# Altium project Sound_Card.PrjPcb
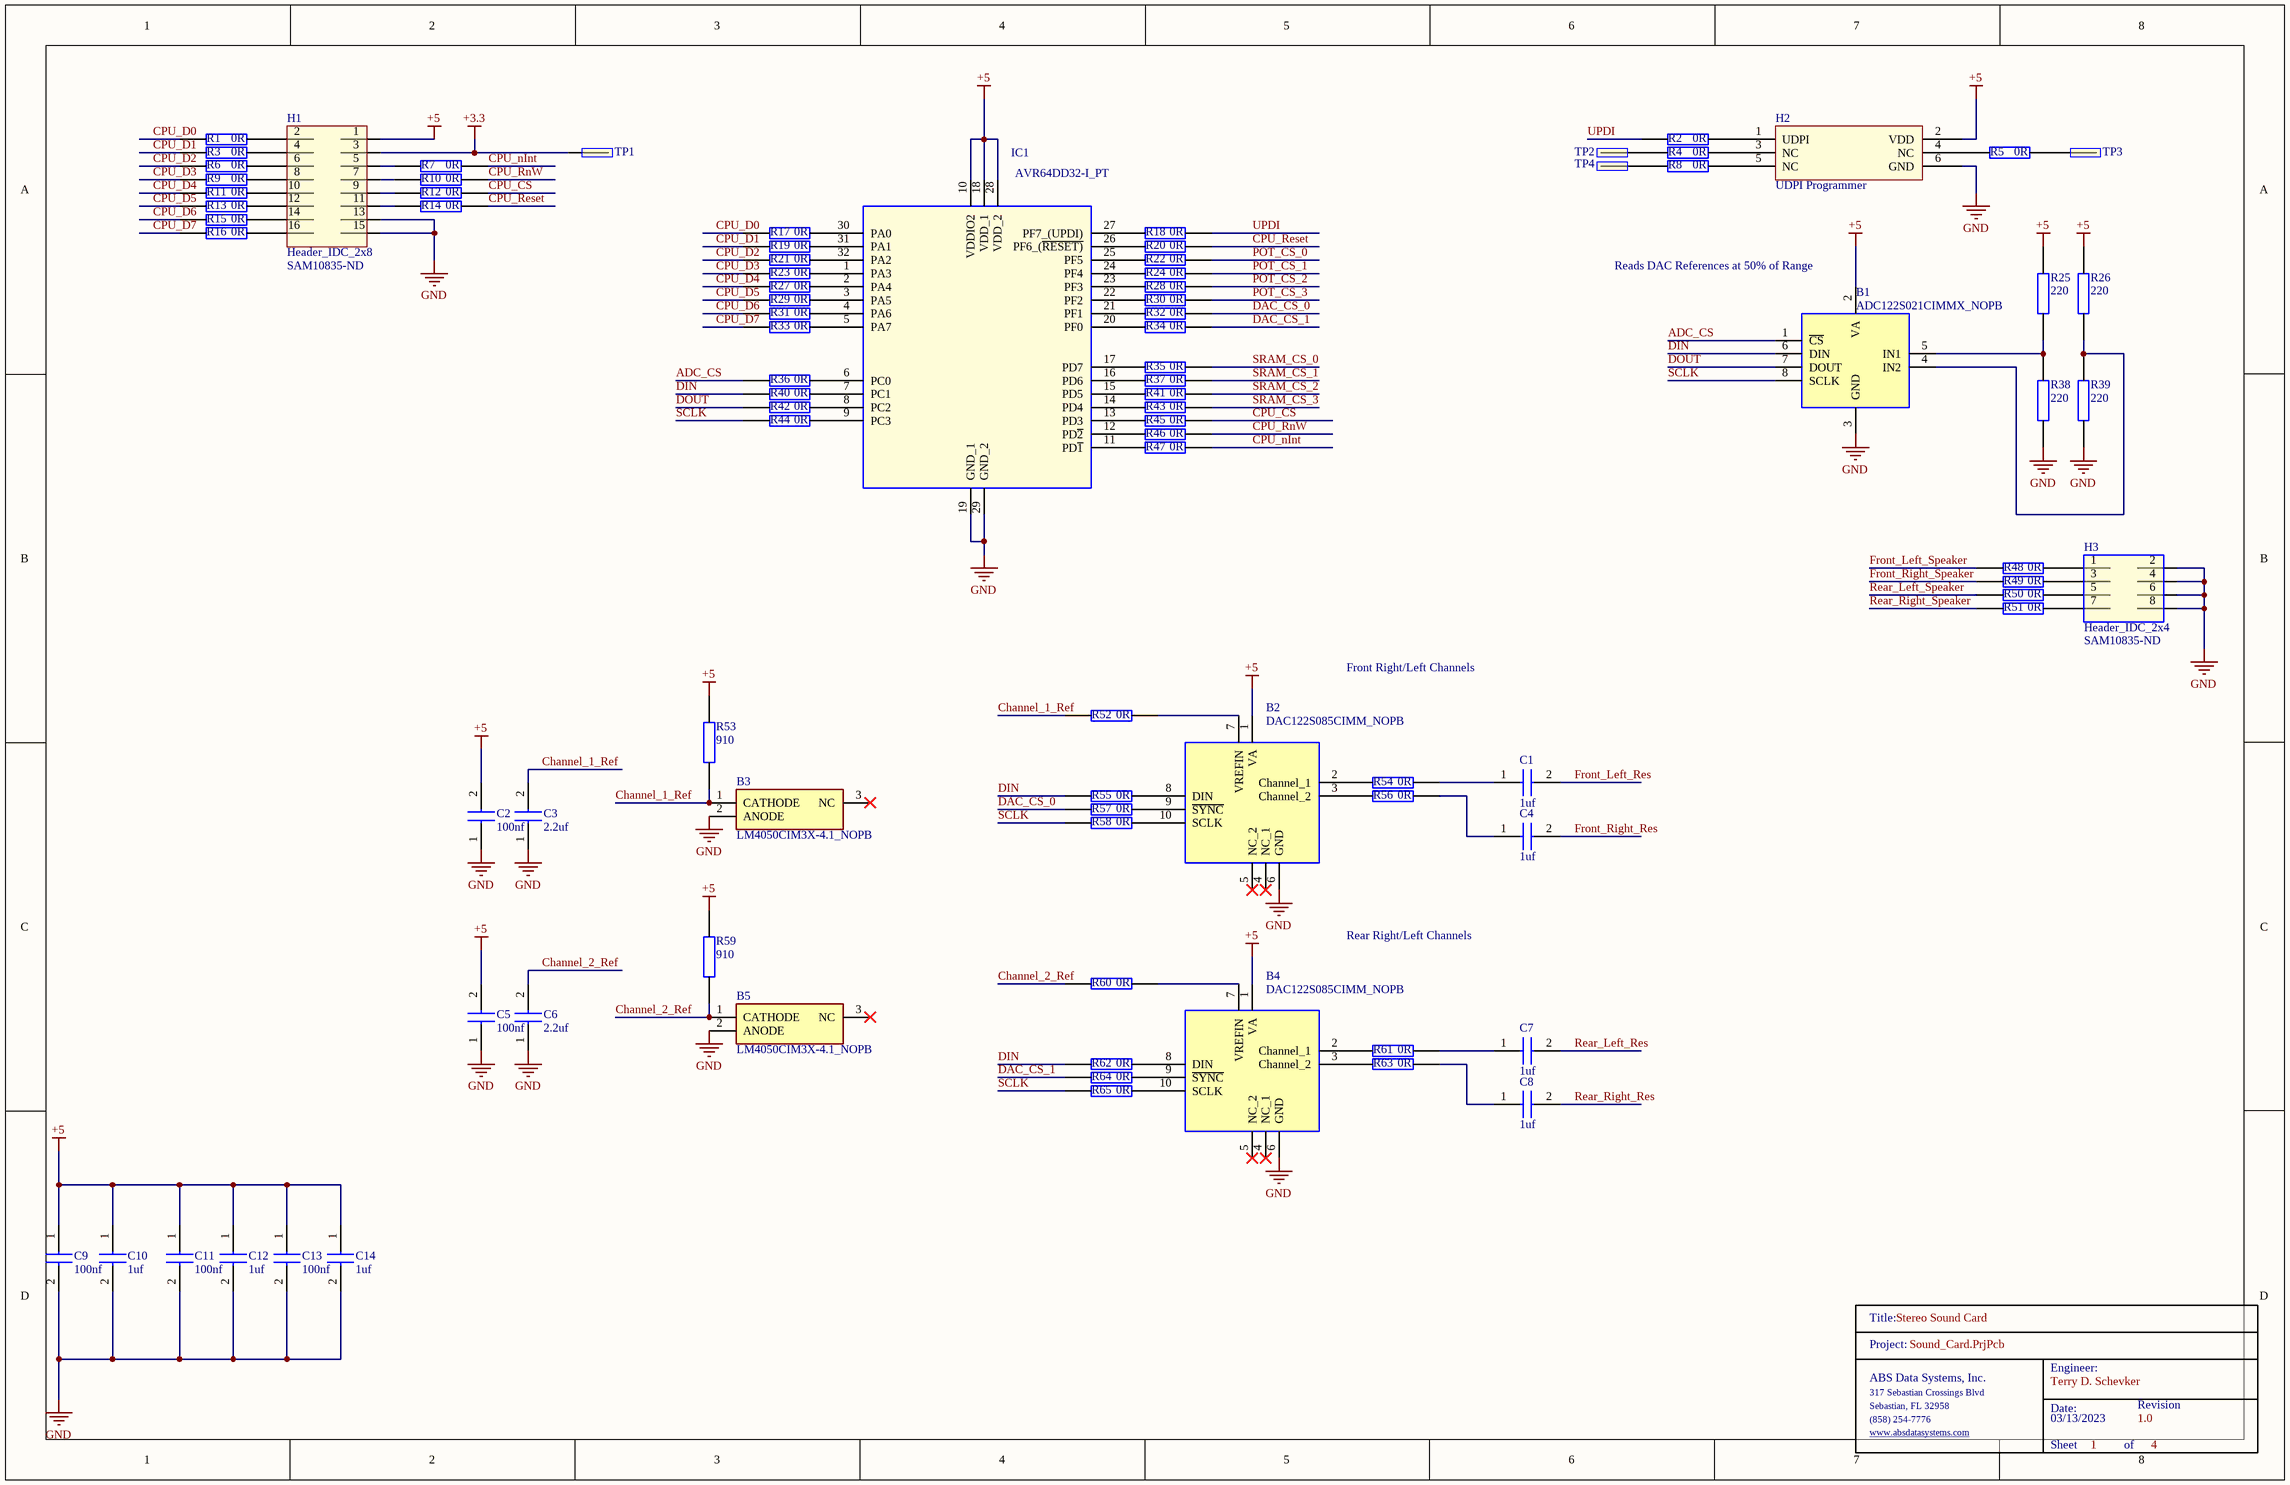
[diagram p0: Sound_Card.SchDoc]
4 sheets, 271 parts. Net scope: global (net labels, ports and power ports of the same name join across sheets).
Board file: Sound_Card_PCB.PcbDoc
Sheets:
  Sound_Card.SchDoc
  Ampifiler.SchDoc
  Sound_Ram_Buffer.SchDoc
  Sound_Card_LED_Monitor.SchDoc

## Sheet Sound_Card.SchDoc: Stereo Sound Card
size Tabloid; Date: 03/13/2023; Engineer: Terry D. Schevker; Revision: 1.0; SheetNumber: 1; SheetTotal: 4

### Parts
B1  ADC122S021CIMMX_NOPB  [SOP65P490X110-8N]
B2  DAC122S085CIMM_NOPB  [SOP50P490X110-10N]
B3  LM4050CIM3X-4.1_NOPB  [SOT95P237X95-3N]
B4  DAC122S085CIMM_NOPB  [SOP50P490X110-10N]
B5  LM4050CIM3X-4.1_NOPB  [SOT95P237X95-3N]
C1  1uf  [0603]
C2  100nf  [0603]
C3  2.2uf  [0603]
C4  1uf  [0603]
C5  100nf  [0603]
C6  2.2uf  [0603]
C7  1uf  [0603]
C8  1uf  [0603]
C9  100nf  [0603]
C10  1uf  [0603]
C11  100nf  [0603]
C12  1uf  [0603]
C13  100nf  [0603]
C14  1uf  [0603]
H1  Header_IDC_2x8  Supplier Part Number 1: SAM10835-ND  [HEADER16]
H2  UDPI Programmer  [HDR2X3]
H3  Header_IDC_2x4  Supplier Part Number 1: SAM10835-ND  [HDR2X4]
IC1  AVR64DD32-I_PT  [QFP80P900X900X120-32N]
R1  0R  [0603]
R2  0R  [0603]
R3  0R  [0603]
R4  0R  [0603]
R5  0R  [0603]
R6  0R  [0603]
R7  0R  [0603]
R8  0R  [0603]
R9  0R  [0603]
R10  0R  [0603]
R11  0R  [0603]
R12  0R  [0603]
R13  0R  [0603]
R14  0R  [0603]
R15  0R  [0603]
R16  0R  [0603]
R17  0R  [0603]
R18  0R  [0603]
R19  0R  [0603]
R20  0R  [0603]
R21  0R  [0603]
R22  0R  [0603]
R23  0R  [0603]
R24  0R  [0603]
R25  220  [0603]
R26  220  [0603]
R27  0R  [0603]
R28  0R  [0603]
R29  0R  [0603]
R30  0R  [0603]
R31  0R  [0603]
R32  0R  [0603]
R33  0R  [0603]
R34  0R  [0603]
R35  0R  [0603]
R36  0R  [0603]
R37  0R  [0603]
R38  220  [0603]
R39  220  [0603]
R40  0R  [0603]
R41  0R  [0603]
R42  0R  [0603]
R43  0R  [0603]
R44  0R  [0603]
R45  0R  [0603]
R46  0R  [0603]
R47  0R  [0603]
R48  0R  [0603]
R49  0R  [0603]
R50  0R  [0603]
R51  0R  [0603]
R52  0R  [0603]
R53  910  [0603]
R54  0R  [0603]
R55  0R  [0603]
R56  0R  [0603]
R57  0R  [0603]
R58  0R  [0603]
R59  910  [0603]
R60  0R  [0603]
R61  0R  [0603]
R62  0R  [0603]
R63  0R  [0603]
R64  0R  [0603]
R65  0R  [0603]
TitleBlock_1  TitleBlock  (value not drawn)  (graphical)
TP1  TP  [TP]  (value not drawn)
TP2  TP  [TP]  (value not drawn)
TP3  TP  [TP]  (value not drawn)
TP4  TP  [TP]  (value not drawn)

### Nets
+3.3: H1.3 TP1.1
+5: B1.2(VA) B2.1(VA) B4.1(VA) C2.2 C5.2 C9.1 C10.1 C11.1 C12.1 C13.1 C14.1 H1.1 H2.2(VDD) IC1.10(VDDIO2) IC1.18(VDD_1) IC1.28(VDD_2) R25.1 R26.2 R53.1 R59.1
GND: B1.3(GND) B2.6(GND) B3.2(ANODE) B4.6(GND) B5.2(ANODE) C2.1 C3.1 C5.1 C6.1 C9.2 C10.2 C11.2 C12.2 C13.2 C14.2 H1.13 H1.15 H2.6(GND) H3.2 H3.4 H3.6 H3.8 IC1.19(GND_1) IC1.29(GND_2) R38.1 R39.2
ADC_CS: B1.1(~{CS}) R36.1
Channel_1_Ref: B3.1(CATHODE) C3.2 R52.1 R53.2
Channel_2_Ref: B5.1(CATHODE) C6.2 R59.2 R60.1
CPU_CS: R12.2 R45.2
CPU_D0: R1.1 R17.1
CPU_D1: R3.1 R19.1
CPU_D2: R6.1 R21.1
CPU_D3: R9.1 R23.1
CPU_D4: R11.1 R27.1
CPU_D5: R13.1 R29.1
CPU_D6: R15.1 R31.1
CPU_D7: R16.1 R33.1
CPU_nInt: R7.2 R47.2
CPU_Reset: R14.2 R20.2
CPU_RnW: R10.2 R46.2
DAC_CS_0: R32.2 R57.1
DAC_CS_1: R34.2 R64.1
DIN: B1.6(DIN) R40.1 R55.1 R62.1
DOUT: B1.7(DOUT) R42.1
Front_Left_Res: C1.2
Front_Left_Speaker: R48.1
Front_Right_Res: C4.2
Front_Right_Speaker: R49.1
POT_CS_0: R22.2
POT_CS_1: R24.2
POT_CS_2: R28.2
POT_CS_3: R30.2
Rear_Left_Res: C7.2
Rear_Left_Speaker: R50.1
Rear_Right_Res: C8.2
Rear_Right_Speaker: R51.1
SCLK: B1.8(SCLK) R44.1 R58.1 R65.1
SRAM_CS_0: R35.2
SRAM_CS_1: R37.2
SRAM_CS_2: R41.2
SRAM_CS_3: R43.2
UPDI: R2.1 R18.2
NetB1_4: B1.4(IN2) R26.1 R39.1
NetB1_5: B1.5(IN1) R25.2 R38.2
NetB2_2: B2.2(Channel_1) R54.1
NetB2_3: B2.3(Channel_2) R56.1
NetB2_7: B2.7(VREFIN) R52.2
NetB2_8: B2.8(DIN) R55.2
NetB2_9: B2.9(~{SYNC}) R57.2
NetB2_10: B2.10(SCLK) R58.2
NetB4_2: B4.2(Channel_1) R61.1
NetB4_3: B4.3(Channel_2) R63.1
NetB4_7: B4.7(VREFIN) R60.2
NetB4_8: B4.8(DIN) R62.2
NetB4_9: B4.9(~{SYNC}) R64.2
NetB4_10: B4.10(SCLK) R65.2
NetC1_1: C1.1 R54.2
NetC4_1: C4.1 R56.2
NetC7_1: C7.1 R61.2
NetC8_1: C8.1 R63.2
NetH1_2: H1.2 R1.2
NetH1_4: H1.4 R3.2
NetH1_5: H1.5 R7.1
NetH1_6: H1.6 R6.2
NetH1_7: H1.7 R10.1
NetH1_8: H1.8 R9.2
NetH1_9: H1.9 R12.1
NetH1_10: H1.10 R11.2
NetH1_11: H1.11 R14.1
NetH1_12: H1.12 R13.2
NetH1_14: H1.14 R15.2
NetH1_16: H1.16 R16.2
NetH2_1: H2.1(UDPI) R2.2
NetH2_3: H2.3(NC) R4.2
NetH2_4: H2.4(NC) R5.1
NetH2_5: H2.5(NC) R8.2
NetH3_1: H3.1 R48.2
NetH3_3: H3.3 R49.2
NetH3_5: H3.5 R50.2
NetH3_7: H3.7 R51.2
NetIC1_1: IC1.1(PA3) R23.2
NetIC1_2: IC1.2(PA4) R27.2
NetIC1_3: IC1.3(PA5) R29.2
NetIC1_4: IC1.4(PA6) R31.2
NetIC1_5: IC1.5(PA7) R33.2
NetIC1_6: IC1.6(PC0) R36.2
NetIC1_7: IC1.7(PC1) R40.2
NetIC1_8: IC1.8(PC2) R42.2
NetIC1_9: IC1.9(PC3) R44.2
NetIC1_11: IC1.11(PD~{1}) R47.1
NetIC1_12: IC1.12(PD~{2}) R46.1
NetIC1_13: IC1.13(PD3) R45.1
NetIC1_14: IC1.14(PD4) R43.1
NetIC1_15: IC1.15(PD5) R41.1
NetIC1_16: IC1.16(PD6) R37.1
NetIC1_17: IC1.17(PD7) R35.1
NetIC1_20: IC1.20(PF0) R34.1
NetIC1_21: IC1.21(PF1) R32.1
NetIC1_22: IC1.22(PF2) R30.1
NetIC1_23: IC1.23(PF3) R28.1
NetIC1_24: IC1.24(PF4) R24.1
NetIC1_25: IC1.25(PF5) R22.1
NetIC1_26: IC1.26(PF6_(~{RESET)}) R20.1
NetIC1_27: IC1.27(PF7_(UPDI)) R18.1
NetIC1_30: IC1.30(PA0) R17.2
NetIC1_31: IC1.31(PA1) R19.2
NetIC1_32: IC1.32(PA2) R21.2
NetR4_1: R4.1 TP2.1
NetR5_2: R5.2 TP3.1
NetR8_1: R8.1 TP4.1

Not connected (* = marked no-connect by the designer): B2 4(NC_1)* 5(NC_2)*; B3 3(NC)*; B4 4(NC_1)* 5(NC_2)*; B5 3(NC)*

### Notes on the sheet
- (near B1) Reads DAC References at 50% of Range
- Front Right/Left Channels
- Rear Right/Left Channels
- (in symbol TitleBlock) Title:; Project:; Engineer:; ABS Data Systems, Inc.; 317 Sebastian Crossings Blvd; Sebastian, FL 32958; Date:; Revision; (858) 254-7776; www.absdatasystems.com; Sheet; of

### Library data of the parts
B1 = ADC122S021CIMMX_NOPB: 2 Channel, 50 ksps to 200 ksps 12-Bit A/D Converter; Manufacturer_Name: Texas Instruments; Manufacturer_Part_Number: ADC122S021CIMMX/NOPB; Geometry.Height: 1.1mm; Mouser Part Number: 926-A122S021CIMMXNPB; Mouser Price/Stock: https://www.mouser.co.uk/ProductDetail/Texas-Instruments/ADC122S021CIMMX-NOPB/?qs=7X5t%252BdzoRHB2bC7Teu8H3A%3D%3D; Datasheet Link: http://www.ti.com/lit/gpn/ADC122S021
B2 B4 = DAC122S085CIMM_NOPB: 12-Bit Micro Power DUAL Digital-to-Analog Converter with Rail-to-Rail Output; Manufacturer_Name: Texas Instruments; Manufacturer_Part_Number: DAC122S085CIMM/NOPB; Geometry.Height: 1.1mm; Mouser Part Number: 926-DAC122S085CIMMNO; Mouser Price/Stock: https://www.mouser.co.uk/ProductDetail/Texas-Instruments/DAC122S085CIMM-NOPB/?qs=7X5t%252BdzoRHCSswOz%252BE6yGA%3D%3D; Datasheet Link: http://www.ti.com/lit/gpn/dac122s085
B3 B5 = LM4050CIM3X-4.1_NOPB: 50ppm/C Precision Micropower Shunt Voltage Reference; Manufacturer_Name: Texas Instruments; Manufacturer_Part_Number: LM4050CIM3X-4.1/NOPB; Geometry.Height: 0.95mm; Mouser Part Number: 926-LM4050CIM3X41NPB; Mouser Price/Stock: https://www.mouser.co.uk/ProductDetail/Texas-Instruments/LM4050CIM3X-4.1-NOPB?qs=QbsRYf82W3Em%2F29oRlpByg%3D%3D; Datasheet Link: http://www.ti.com/lit/gpn/lm4050-n
C1 C4 C7 C8 C10 C12 C14 = CL10B105KA8NNNL: Samsung Electro-Mechanics 0603 1uf
C2 C5 C9 C11 C13 = CL10B104JB8NNNC: Samsung Electro-Mechanics 0603 100nf
C3 C6 = CL10B225KP8NNNC: Samsung Electro-Mechanics 0603 2.2uf
H1 = Header_IDC_2x8: 16 Pin 2x8 Through Hold IDC Connector; Manufacturer: Samtec; Manufacturer Part Number: TST-108-01-G-D; Number of Contacts: 16; Gender: Male; Connector Type: Male Pin; Pitch: 2.54mm; Row Spacing: 0.1inch; Supplier 1: Digi-Key; RoHS: Yes; Category: Headers and Wire Housings; Stock 1: 227; Pricing 1: 1=2.85000, 10=2.73600, 100=2.28000, 500=1.93800, 1000=1.65300, 5000=1.48200 (USD); Mount: Through Hole; Contact Plating: Gold; Contact Material: Bronze; Housing Material: Polyester; Housing Color: Black; Color: Black; Min Operating Temperature: -55°C; Max Operating Temperature: 125°C; Number of Rows: 2; Termination: Solder; Packaging: Rail/Tube; Orientation: Straight; Number of Positions: 16; Length: 27.94mm; Depth: 9.27mm; Contact Mating Length: 0.25inch; REACH SVHC: No SVHC; ComponentLink1URL: https://datasheet.ciiva.com/739/tst-mkt-739845.pdf?src-supplier=Digi-Key; ComponentLink1Description: https://datasheet.ciiva.com/739/tst-mkt-739845.pdf?src-supplier=Digi-Key; ComponentLink2URL: https://datasheet.ciiva.com/10018/htst-10018510.pdf?src-supplier=Avnet; ComponentLink2Description: https://datasheet.ciiva.com/10018/htst-10018510.pdf?src-supplier=Avnet
H2 = UDPI Programmer: 6 Pin 2X3 Through Hole Header
H3 = Header_IDC_2x4: 8 Pin 2x4 Through Hold IDC Connector; Manufacturer: Samtec; Manufacturer Part Number: TST-105-01-G-D; Number of Contacts: 16; Gender: Male; Connector Type: Male Pin; Pitch: 2.54mm; Row Spacing: 0.1inch; Supplier 1: Digi-Key; RoHS: Yes; Category: Headers and Wire Housings; Stock 1: 227; Pricing 1: 1=2.85000, 10=2.73600, 100=2.28000, 500=1.93800, 1000=1.65300, 5000=1.48200 (USD); Mount: Through Hole; Contact Plating: Gold; Contact Material: Bronze; Housing Material: Polyester; Housing Color: Black; Color: Black; Min Operating Temperature: -55°C; Max Operating Temperature: 125°C; Number of Rows: 2; Termination: Solder; Packaging: Rail/Tube; Orientation: Straight; Number of Positions: 16; Length: 27.94mm; Depth: 9.27mm; Contact Mating Length: 0.25inch; REACH SVHC: No SVHC; ComponentLink1URL: https://datasheet.ciiva.com/739/tst-mkt-739845.pdf?src-supplier=Digi-Key; ComponentLink1Description: https://datasheet.ciiva.com/739/tst-mkt-739845.pdf?src-supplier=Digi-Key; ComponentLink2URL: https://datasheet.ciiva.com/10018/htst-10018510.pdf?src-supplier=Avnet; ComponentLink2Description: https://datasheet.ciiva.com/10018/htst-10018510.pdf?src-supplier=Avnet
IC1 = AVR64DD32-I_PT: Integrated Circuit; Manufacturer_Name: Microchip; Manufacturer_Part_Number: AVR64DD32-I/PT | MULTI-VOLTAGE I/O; Datasheet Link: https://www.microchip.com/en-us/product/AVR64DD32; Height: 1.2mm
R1-R24 R27-R37 R40-R52 R54-R58 R60-R65 = RC0603JR-070RL: YAGEO 0603 0 ohm; Manufacturer_Name: KEMET; Geometry.Height: 0.55mm; Mouser Part Number: 603-RC0603JR-070RL; Mouser Price/Stock: https://www.mouser.co.uk/ProductDetail/YAGEO/RC0603JR-070RL?qs=2cAdsCoAWRGWyPcuXgGiXQ%3D%3D; Manufacturer_Part_Number: RC0603JR-070RL; Datasheet Link: https://datasheet.datasheetarchive.com/originals/distributors/Datasheets_SAMA/902f9e387b938f871d31120f5fc1d65e.pdf
R25 R26 R38 R39 = RC0603JR-07220RL: YAGEO 0603 220 ohm; Manufacturer_Name: KEMET; Manufacturer_Part_Number: RC0603JR-070RL; Geometry.Height: 0.55mm; Mouser Part Number: 603-RC0603JR-070RL; Mouser Price/Stock: https://www.mouser.co.uk/ProductDetail/YAGEO/RC0603JR-070RL?qs=2cAdsCoAWRGWyPcuXgGiXQ%3D%3D; Datasheet Link: https://datasheet.datasheetarchive.com/originals/distributors/Datasheets_SAMA/902f9e387b938f871d31120f5fc1d65e.pdf
R53 R59 = RT0603BRC07910RL: YAGEO 0603 910 ohm; Manufacturer_Name: KEMET; Manufacturer_Part_Number: RC0603JR-070RL; Geometry.Height: 0.55mm; Mouser Part Number: 603-RC0603JR-070RL; Mouser Price/Stock: https://www.mouser.co.uk/ProductDetail/YAGEO/RC0603JR-070RL?qs=2cAdsCoAWRGWyPcuXgGiXQ%3D%3D; Datasheet Link: https://datasheet.datasheetarchive.com/originals/distributors/Datasheets_SAMA/902f9e387b938f871d31120f5fc1d65e.pdf
TP1-TP4 = TP: Manufacturer: Samtec; Manufacturer Part Number: TST-105-01-G-D; Number of Contacts: 16; Gender: Male; Connector Type: Male Pin; Pitch: 2.54mm; Row Spacing: 0.1inch; Supplier 1: Digi-Key; RoHS: Yes; Category: Headers and Wire Housings; Stock 1: 227; Pricing 1: 1=2.85000, 10=2.73600, 100=2.28000, 500=1.93800, 1000=1.65300, 5000=1.48200 (USD); Mount: Through Hole; Contact Plating: Gold; Contact Material: Bronze; Housing Material: Polyester; Housing Color: Black; Color: Black; Min Operating Temperature: -55°C; Max Operating Temperature: 125°C; Number of Rows: 2; Termination: Solder; Packaging: Rail/Tube; Orientation: Straight; Number of Positions: 16; Length: 27.94mm; Depth: 9.27mm; Contact Mating Length: 0.25inch; REACH SVHC: No SVHC; ComponentLink1URL: https://datasheet.ciiva.com/739/tst-mkt-739845.pdf?src-supplier=Digi-Key; ComponentLink1Description: https://datasheet.ciiva.com/739/tst-mkt-739845.pdf?src-supplier=Digi-Key; ComponentLink2URL: https://datasheet.ciiva.com/10018/htst-10018510.pdf?src-supplier=Avnet; ComponentLink2Description: https://datasheet.ciiva.com/10018/htst-10018510.pdf?src-supplier=Avnet

## Sheet Ampifiler.SchDoc: Sound Card Amplifiers
size Tabloid; Date: 05/10/2023; Engineer: Terry D. Scchevker; Revision: 1.0; SheetNumber: 2; SheetTotal: 4
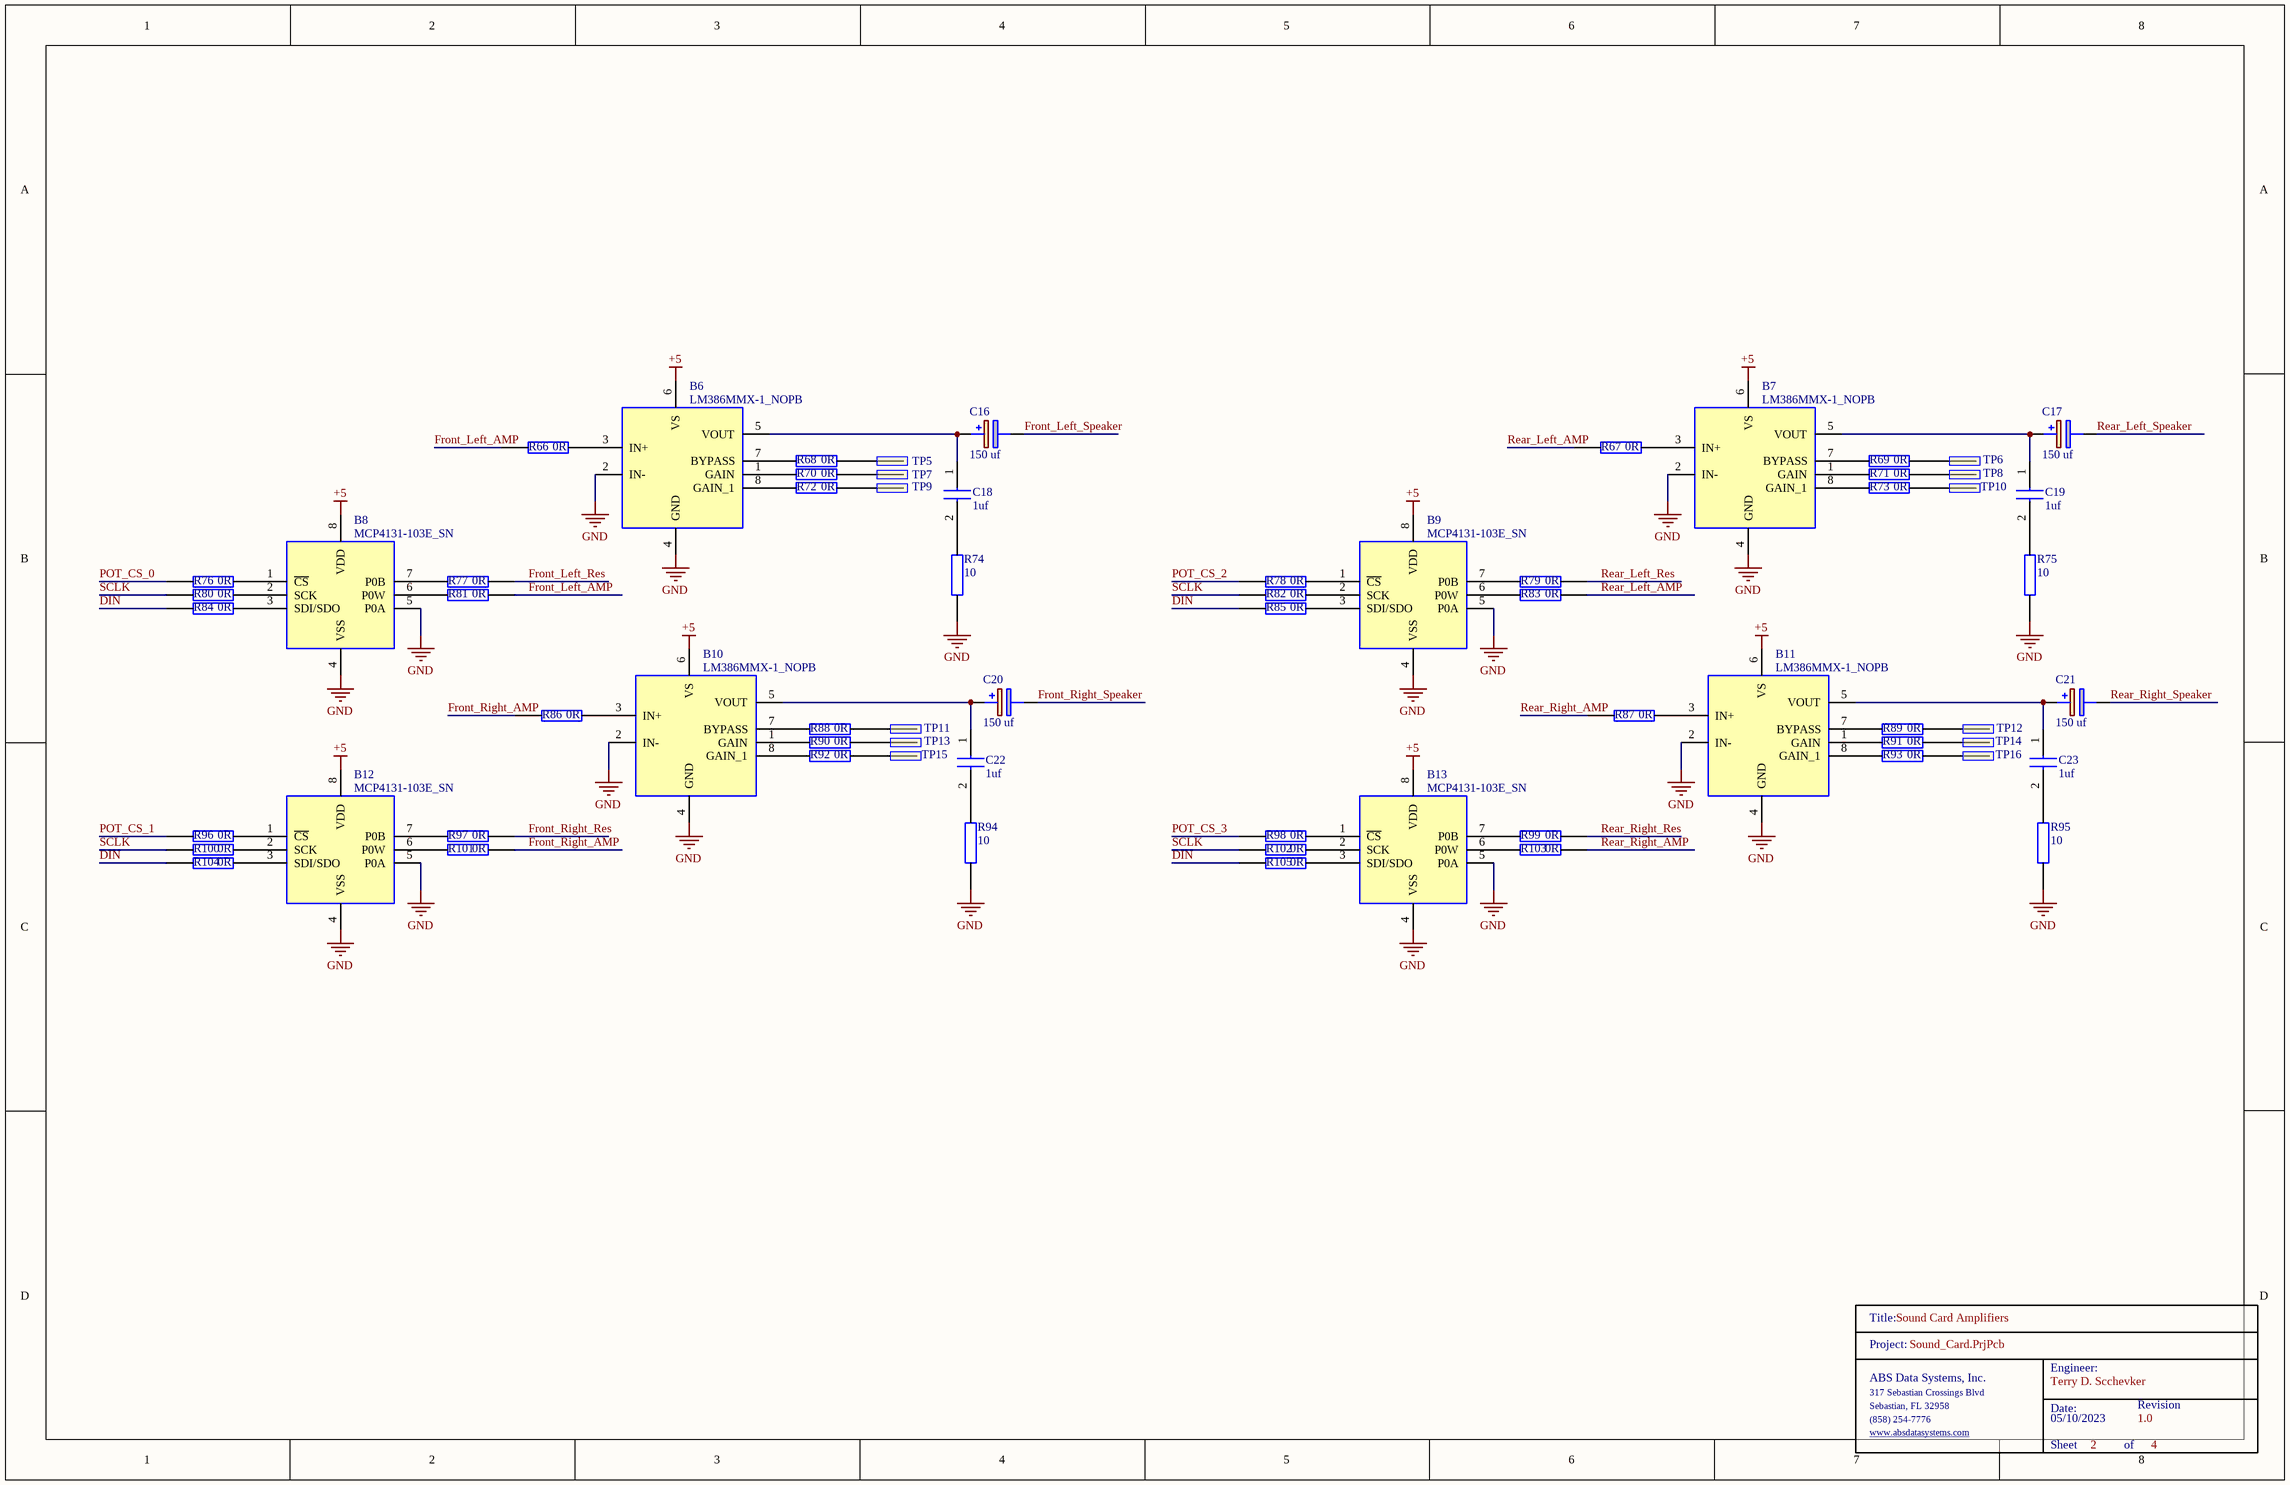
[diagram p1: Ampifiler.SchDoc]

### Parts
(Parts that share a designator on the sheet are numbered #1, #2 ... from top to bottom, then left to right.)
B6  LM386MMX-1_NOPB  [SOP65P490X110-8N]
B7  LM386MMX-1_NOPB  [SOP65P490X110-8N]
B8  MCP4131-103E_SN  [SOIC127P600X175-8N]
B9  MCP4131-103E_SN  [SOIC127P600X175-8N]
B10  LM386MMX-1_NOPB  [SOP65P490X110-8N]
B11  LM386MMX-1_NOPB  [SOP65P490X110-8N]
B12  MCP4131-103E_SN  [SOIC127P600X175-8N]
B13  MCP4131-103E_SN  [SOIC127P600X175-8N]
C16  150 uf  [CAPAE830X1050N]
C17  150 uf  [CAPAE830X1050N]
C18  1uf  [0603]
C19  1uf  [0603]
C20  150 uf  [CAPAE830X1050N]
C21  150 uf  [CAPAE830X1050N]
C22  1uf  [0603]
C23  1uf  [0603]
R66  0R  [0603]
R67  0R  [0603]
R68  0R  [0603]
R69  0R  [0603]
R70  0R  [0603]
R71  0R  [0603]
R72  0R  [0603]
R73  0R  [0603]
R74  10  [0603]
R75  10  [0603]
R76  0R  [0603]
R77  0R  [0603]
R78  0R  [0603]
R79  0R  [0603]
R80  0R  [0603]
R81  0R  [0603]
R82  0R  [0603]
R83  0R  [0603]
R84  0R  [0603]
R85  0R  [0603]
R86  0R  [0603]
R87  0R  [0603]
R88  0R  [0603]
R89  0R  [0603]
R90  0R  [0603]
R91  0R  [0603]
R92  0R  [0603]
R93  0R  [0603]
R94  10  [0603]
R95  10  [0603]
R96  0R  [0603]
R97  0R  [0603]
R98  0R  [0603]
R99  0R  [0603]
R100  0R  [0603]
R101  0R  [0603]
R102  0R  [0603]
R103  0R  [0603]
R104  0R  [0603]
R105  0R  [0603]
TitleBlock_?#1  TitleBlock  (value not drawn)  (graphical)
TP5  TP  [TP]  (value not drawn)
TP6  TP  [TP]  (value not drawn)
TP7  TP  [TP]  (value not drawn)
TP8  TP  [TP]  (value not drawn)
TP9  TP  [TP]  (value not drawn)
TP10  TP  [TP]  (value not drawn)
TP11  TP  [TP]  (value not drawn)
TP12  TP  [TP]  (value not drawn)
TP13  TP  [TP]  (value not drawn)
TP14  TP  [TP]  (value not drawn)
TP15  TP  [TP]  (value not drawn)
TP16  TP  [TP]  (value not drawn)

### Nets
+5: B6.6(VS) B7.6(VS) B8.8(VDD) B9.8(VDD) B10.6(VS) B11.6(VS) B12.8(VDD) B13.8(VDD)
GND: B6.2(IN-) B6.4(GND) B7.2(IN-) B7.4(GND) B8.4(VSS) B8.5(P0A) B9.4(VSS) B9.5(P0A) B10.2(IN-) B10.4(GND) B11.2(IN-) B11.4(GND) B12.4(VSS) B12.5(P0A) B13.4(VSS) B13.5(P0A) R74.1 R75.1 R94.1 R95.1
DIN: R84.1 R85.1 R104.1 R105.1
Front_Left_AMP: R66.1 R81.2
Front_Left_Res: R77.2
Front_Left_Speaker: C16.2(-)
Front_Right_AMP: R86.1 R101.2
Front_Right_Res: R97.2
Front_Right_Speaker: C20.2(-)
POT_CS_0: R76.1
POT_CS_1: R96.1
POT_CS_2: R78.1
POT_CS_3: R98.1
Rear_Left_AMP: R67.1 R83.2
Rear_Left_Res: R79.2
Rear_Left_Speaker: C17.2(-)
Rear_Right_AMP: R87.1 R103.2
Rear_Right_Res: R99.2
Rear_Right_Speaker: C21.2(-)
SCLK: R80.1 R82.1 R100.1 R102.1
NetB6_1: B6.1(GAIN) R70.1
NetB6_3: B6.3(IN+) R66.2
NetB6_5: B6.5(VOUT) C16.1(+) C18.1
NetB6_7: B6.7(BYPASS) R68.1
NetB6_8: B6.8(GAIN_1) R72.1
NetB7_1: B7.1(GAIN) R71.1
NetB7_3: B7.3(IN+) R67.2
NetB7_5: B7.5(VOUT) C17.1(+) C19.1
NetB7_7: B7.7(BYPASS) R69.1
NetB7_8: B7.8(GAIN_1) R73.1
NetB8_1: B8.1(~{CS}) R76.2
NetB8_2: B8.2(SCK) R80.2
NetB8_3: B8.3(SDI/SDO) R84.2
NetB8_6: B8.6(P0W) R81.1
NetB8_7: B8.7(P0B) R77.1
NetB9_1: B9.1(~{CS}) R78.2
NetB9_2: B9.2(SCK) R82.2
NetB9_3: B9.3(SDI/SDO) R85.2
NetB9_6: B9.6(P0W) R83.1
NetB9_7: B9.7(P0B) R79.1
NetB10_1: B10.1(GAIN) R90.1
NetB10_3: B10.3(IN+) R86.2
NetB10_5: B10.5(VOUT) C20.1(+) C22.1
NetB10_7: B10.7(BYPASS) R88.1
NetB10_8: B10.8(GAIN_1) R92.1
NetB11_1: B11.1(GAIN) R91.1
NetB11_3: B11.3(IN+) R87.2
NetB11_5: B11.5(VOUT) C21.1(+) C23.1
NetB11_7: B11.7(BYPASS) R89.1
NetB11_8: B11.8(GAIN_1) R93.1
NetB12_1: B12.1(~{CS}) R96.2
NetB12_2: B12.2(SCK) R100.2
NetB12_3: B12.3(SDI/SDO) R104.2
NetB12_6: B12.6(P0W) R101.1
NetB12_7: B12.7(P0B) R97.1
NetB13_1: B13.1(~{CS}) R98.2
NetB13_2: B13.2(SCK) R102.2
NetB13_3: B13.3(SDI/SDO) R105.2
NetB13_6: B13.6(P0W) R103.1
NetB13_7: B13.7(P0B) R99.1
NetC18_2: C18.2 R74.2
NetC19_2: C19.2 R75.2
NetC22_2: C22.2 R94.2
NetC23_2: C23.2 R95.2
NetR68_2: R68.2 TP5.1
NetR69_2: R69.2 TP6.1
NetR70_2: R70.2 TP7.1
NetR71_2: R71.2 TP8.1
NetR72_2: R72.2 TP9.1
NetR73_2: R73.2 TP10.1
NetR88_2: R88.2 TP11.1
NetR89_2: R89.2 TP12.1
NetR90_2: R90.2 TP13.1
NetR91_2: R91.2 TP14.1
NetR92_2: R92.2 TP15.1
NetR93_2: R93.2 TP16.1

### Notes on the sheet
- (in symbol TitleBlock) Title:; Project:; Engineer:; ABS Data Systems, Inc.; 317 Sebastian Crossings Blvd; Sebastian, FL 32958; Date:; Revision; (858) 254-7776; www.absdatasystems.com; Sheet; of

### Library data of the parts
B6 B7 B10 B11 = LM386MMX-1_NOPB: Wide Input Voltage Low Power Audio Amplifier with Internal Gain; Manufacturer_Name: Texas Instruments; Manufacturer_Part_Number: LM386MMX-1/NOPB; Geometry.Height: 1.1mm; Mouser Part Number: 926-LM386MMX-1/NOPB; Mouser Price/Stock: https://www.mouser.co.uk/ProductDetail/Texas-Instruments/LM386MMX-1-NOPB?qs=QbsRYf82W3EjpN1OWIJmZA%3D%3D; Datasheet Link: http://www.ti.com/lit/gpn/lm386
B8 B9 B12 B13 = MCP4131-103E_SN: Digital Potentiometer 128 Step 10kOhm; Manufacturer_Name: Microchip; Manufacturer_Part_Number: MCP4132-103E/SN; Geometry.Height: 1.75mm; Mouser Part Number: 579-MCP4132-103E/SN; Mouser Price/Stock: https://www.mouser.co.uk/ProductDetail/Microchip-Technology/MCP4132-103E-SN?qs=hH%252BOa0VZEiDq5PW83qTf7Q%3D%3D; Datasheet Link: http://ww1.microchip.com/downloads/en/DeviceDoc/22060b.pdf
C16 C17 C20 C21 = 865080553013: Wurth Elektronik 150uF 35 V dc Aluminium Electrolytic Capacitor, WCAP-ASLI Series 2000h 8 (Dia.) x 10.35mm; Geometry.Height: 10.5mm; Mouser Part Number: 710-865080553013; Mouser Price/Stock: https://www.mouser.co.uk/ProductDetail/Wurth-Elektronik/865080553013?qs=0KOYDY2FL29Thrvp1T0nKg%3D%3D; Manufacturer_Name: Wurth Elektronik; Manufacturer_Part_Number: 865080553013; Datasheet Link: https://www.we-online.com/catalog/datasheet/865080553013.pdf
C18 C19 C22 C23 = CL10B105KA8NNNL: Samsung Electro-Mechanics 0603 1uf
R66-R73 R76-R93 R96-R105 = RC0603JR-070RL: as R1 on sheet Sound_Card; Mouser Part Number: 603-RC0603JR-070RL; Mouser Price/Stock: https://www.mouser.co.uk/ProductDetail/YAGEO/RC0603JR-070RL?qs=2cAdsCoAWRGWyPcuXgGiXQ%3D%3D; Manufacturer_Part_Number: RC0603JR-070RL; Datasheet Link: https://datasheet.datasheetarchive.com/originals/distributors/Datasheets_SAMA/902f9e387b938f871d31120f5fc1d65e.pdf
R74 R75 R94 R95 = RC0603JR-0710L: YAGEO 0603 10 ohm; Manufacturer_Name: KEMET; Manufacturer_Part_Number: RC0603JR-070RL; Geometry.Height: 0.55mm; Mouser Part Number: 603-RC0603JR-070RL; Mouser Price/Stock: https://www.mouser.co.uk/ProductDetail/YAGEO/RC0603JR-070RL?qs=2cAdsCoAWRGWyPcuXgGiXQ%3D%3D; Datasheet Link: https://datasheet.datasheetarchive.com/originals/distributors/Datasheets_SAMA/902f9e387b938f871d31120f5fc1d65e.pdf
TP5-TP16 = TP: as TP1 on sheet Sound_Card; Supplier 1: Digi-Key; RoHS: Yes; Category: Headers and Wire Housings; Stock 1: 227; Pricing 1: 1=2.85000, 10=2.73600, 100=2.28000, 500=1.93800, 1000=1.65300, 5000=1.48200 (USD); Mount: Through Hole; Contact Plating: Gold; Contact Material: Bronze; Housing Material: Polyester; Housing Color: Black; Color: Black; Min Operating Temperature: -55°C; Max Operating Temperature: 125°C; Number of Rows: 2; Termination: Solder; Packaging: Rail/Tube; Orientation: Straight; Number of Positions: 16; Length: 27.94mm; Depth: 9.27mm; Contact Mating Length: 0.25inch; REACH SVHC: No SVHC; ComponentLink1URL: https://datasheet.ciiva.com/739/tst-mkt-739845.pdf?src-supplier=Digi-Key; ComponentLink1Description: https://datasheet.ciiva.com/739/tst-mkt-739845.pdf?src-supplier=Digi-Key; ComponentLink2URL: https://datasheet.ciiva.com/10018/htst-10018510.pdf?src-supplier=Avnet; ComponentLink2Description: https://datasheet.ciiva.com/10018/htst-10018510.pdf?src-supplier=Avnet

## Sheet Sound_Ram_Buffer.SchDoc
size Tabloid; SheetNumber: 3; SheetTotal: 4
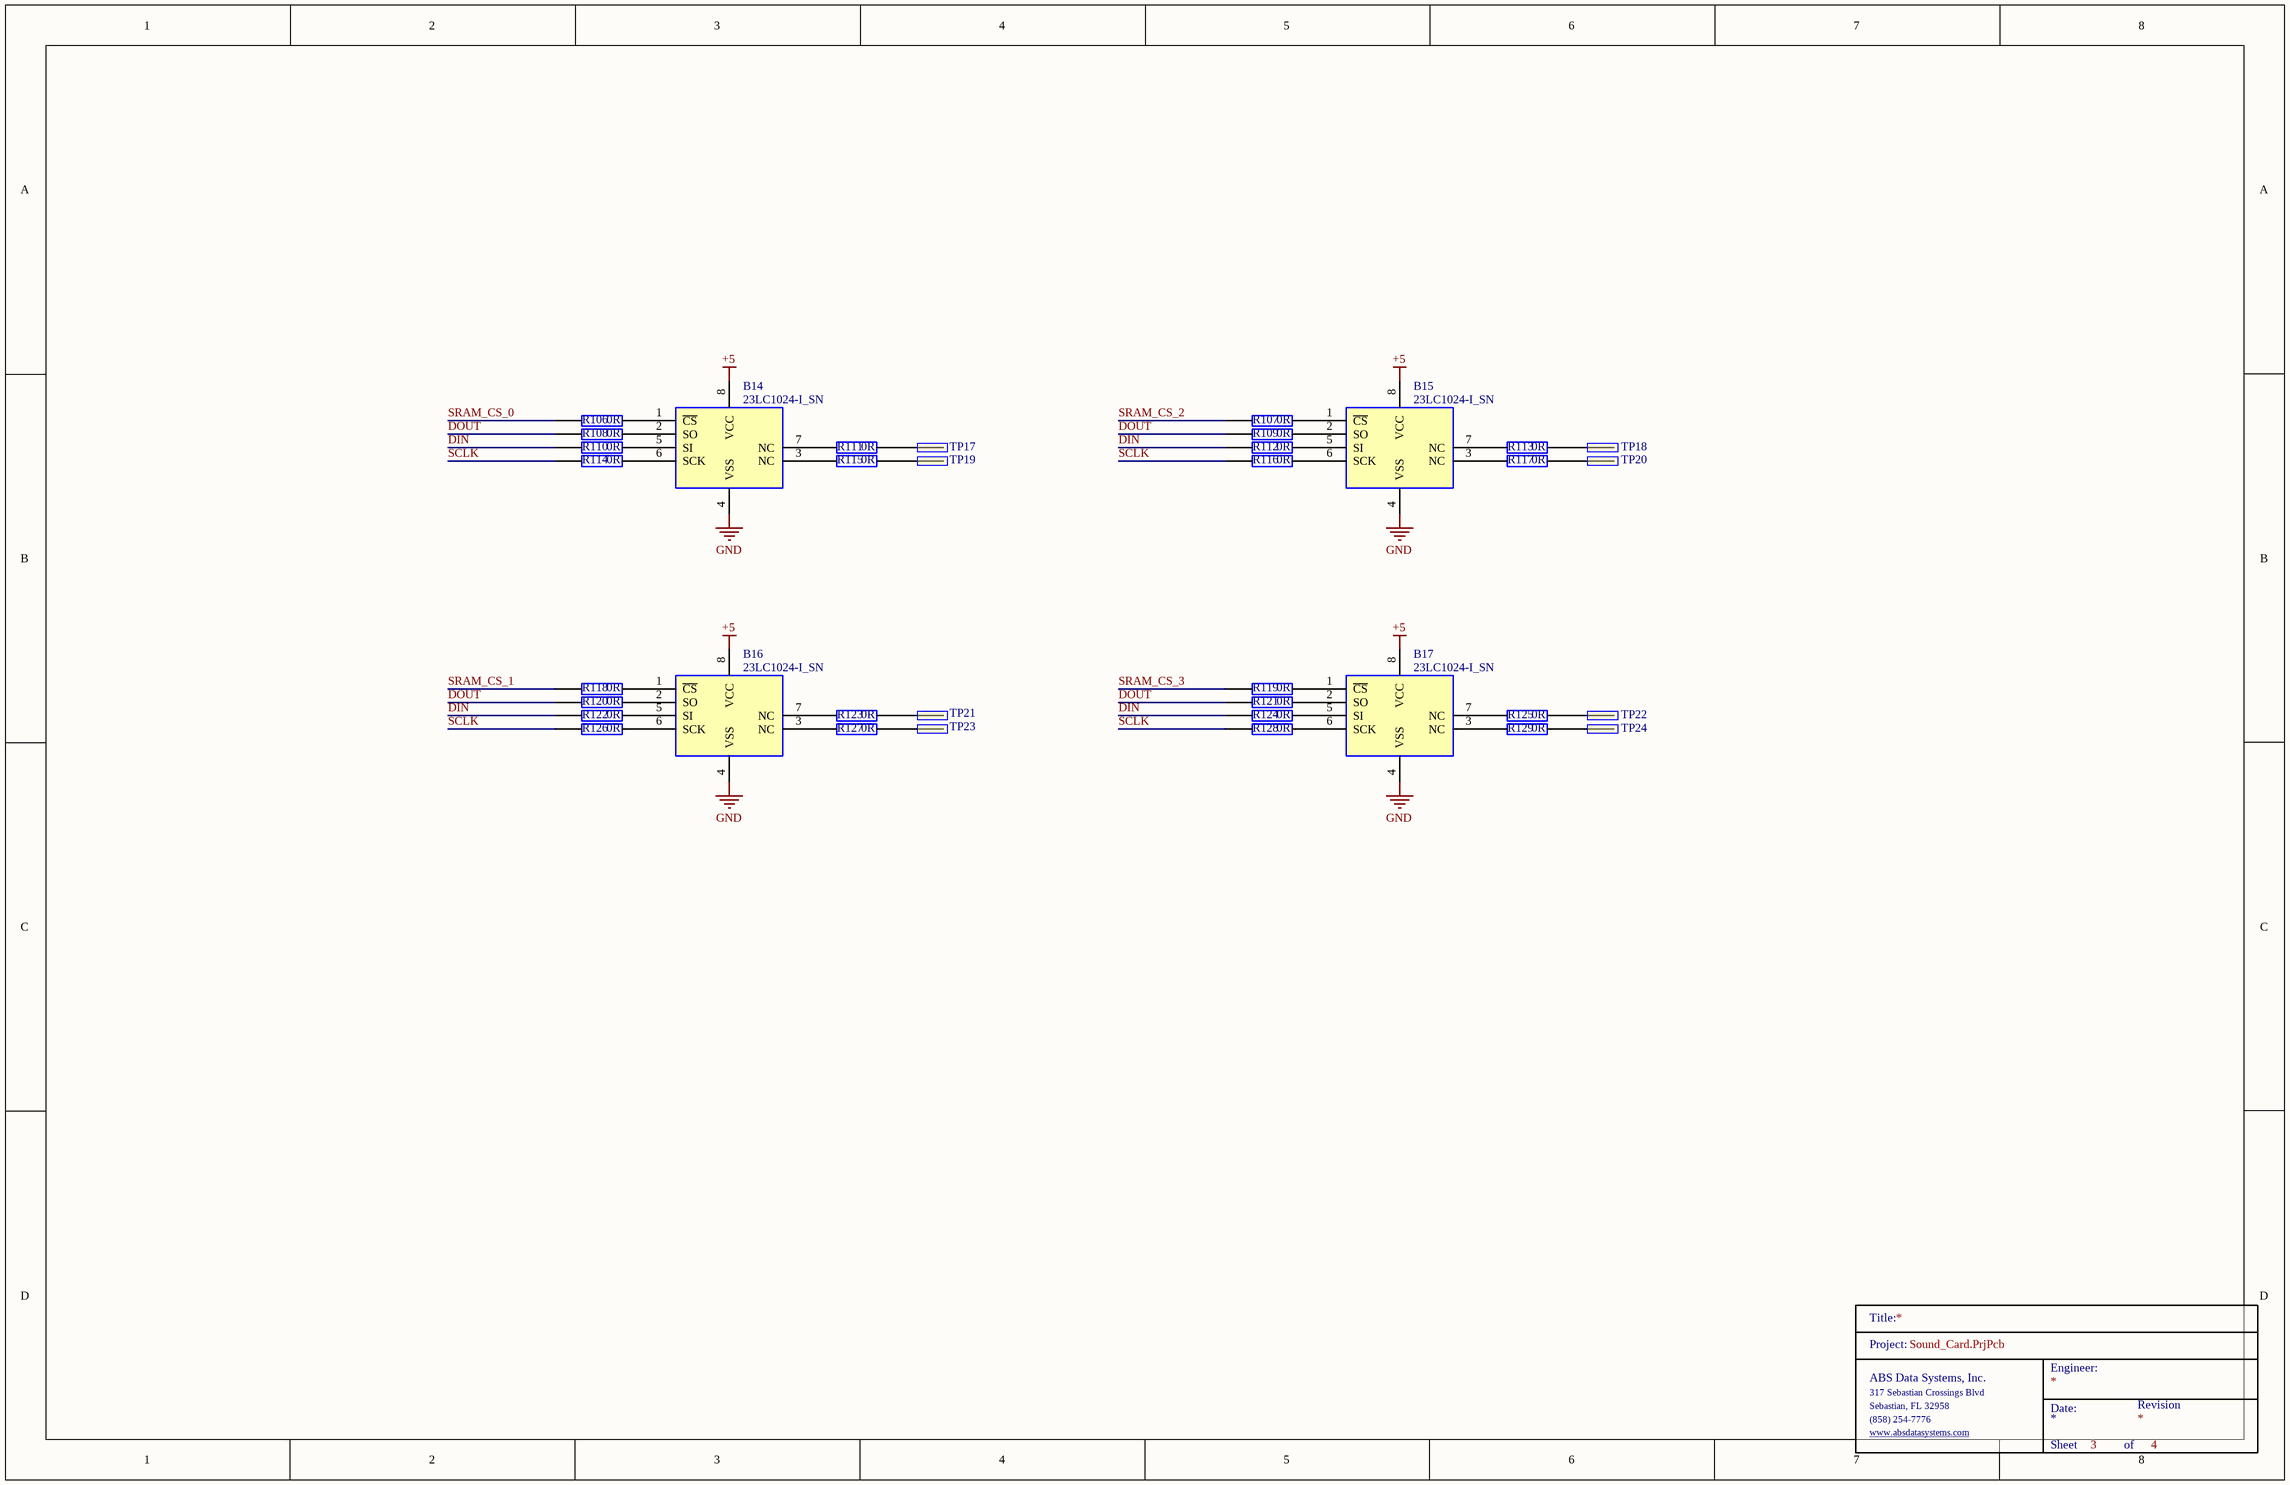
[diagram p2: Sound_Ram_Buffer.SchDoc]

### Parts
(Parts that share a designator on the sheet are numbered #1, #2 ... from top to bottom, then left to right.)
B14  23LC1024-I_SN  [SOIC127P600X175-8N]
B15  23LC1024-I_SN  [SOIC127P600X175-8N]
B16  23LC1024-I_SN  [SOIC127P600X175-8N]
B17  23LC1024-I_SN  [SOIC127P600X175-8N]
R106  0R  [0603]
R107  0R  [0603]
R108  0R  [0603]
R109  0R  [0603]
R110  0R  [0603]
R111  0R  [0603]
R112  0R  [0603]
R113  0R  [0603]
R114  0R  [0603]
R115  0R  [0603]
R116  0R  [0603]
R117  0R  [0603]
R118  0R  [0603]
R119  0R  [0603]
R120  0R  [0603]
R121  0R  [0603]
R122  0R  [0603]
R123  0R  [0603]
R124  0R  [0603]
R125  0R  [0603]
R126  0R  [0603]
R127  0R  [0603]
R128  0R  [0603]
R129  0R  [0603]
TitleBlock_?#2  TitleBlock  (value not drawn)  (graphical)
TP17  TP  [TP]  (value not drawn)
TP18  TP  [TP]  (value not drawn)
TP19  TP  [TP]  (value not drawn)
TP20  TP  [TP]  (value not drawn)
TP21  TP  [TP]  (value not drawn)
TP22  TP  [TP]  (value not drawn)
TP23  TP  [TP]  (value not drawn)
TP24  TP  [TP]  (value not drawn)

### Nets
+5: B14.8(VCC) B15.8(VCC) B16.8(VCC) B17.8(VCC)
GND: B14.4(VSS) B15.4(VSS) B16.4(VSS) B17.4(VSS)
DIN: R110.1 R112.1 R122.1 R124.1
DOUT: R108.1 R109.1 R120.1 R121.1
SCLK: R114.1 R116.1 R126.1 R128.1
SRAM_CS_0: R106.1
SRAM_CS_1: R118.1
SRAM_CS_2: R107.1
SRAM_CS_3: R119.1
NetB14_1: B14.1(~{CS}) R106.2
NetB14_2: B14.2(SO) R108.2
NetB14_3: B14.3(NC) R115.1
NetB14_5: B14.5(SI) R110.2
NetB14_6: B14.6(SCK) R114.2
NetB14_7: B14.7(NC) R111.1
NetB15_1: B15.1(~{CS}) R107.2
NetB15_2: B15.2(SO) R109.2
NetB15_3: B15.3(NC) R117.1
NetB15_5: B15.5(SI) R112.2
NetB15_6: B15.6(SCK) R116.2
NetB15_7: B15.7(NC) R113.1
NetB16_1: B16.1(~{CS}) R118.2
NetB16_2: B16.2(SO) R120.2
NetB16_3: B16.3(NC) R127.1
NetB16_5: B16.5(SI) R122.2
NetB16_6: B16.6(SCK) R126.2
NetB16_7: B16.7(NC) R123.1
NetB17_1: B17.1(~{CS}) R119.2
NetB17_2: B17.2(SO) R121.2
NetB17_3: B17.3(NC) R129.1
NetB17_5: B17.5(SI) R124.2
NetB17_6: B17.6(SCK) R128.2
NetB17_7: B17.7(NC) R125.1
NetR111_2: R111.2 TP17.1
NetR113_2: R113.2 TP18.1
NetR115_2: R115.2 TP19.1
NetR117_2: R117.2 TP20.1
NetR123_2: R123.2 TP21.1
NetR125_2: R125.2 TP22.1
NetR127_2: R127.2 TP23.1
NetR129_2: R129.2 TP24.1

### Notes on the sheet
- (in symbol TitleBlock) Title:; Project:; Engineer:; ABS Data Systems, Inc.; 317 Sebastian Crossings Blvd; Sebastian, FL 32958; Date:; Revision; (858) 254-7776; www.absdatasystems.com; Sheet; of

### Library data of the parts
B14-B17 = 23LC1024-I_SN: SRAM,1Mbit,2.5V,20MHz,SPI/SDI/SQI,SOIC8 23LC1024-I/SN,  SRAM Memory 1Mbit, 128K words x 8 bit, 20MHz,, 2.5 to 5.5 V, 8-Pin, SOIC; Manufacturer_Name: Microchip; Geometry.Height: 1.75mm; Mouser Part Number: 579-23LC1024-I/SN; Mouser Price/Stock: https://www.mouser.co.uk/ProductDetail/Microchip-Technology-Atmel/23LC1024-I-SN?qs=q1LPnGnpSmb1WpXt0vqW%2FQ%3D%3D; Manufacturer_Part_Number: 23LC1024-I/SN; Datasheet Link: http://ww1.microchip.com/downloads/en/DeviceDoc/20005142C.pdf
R106-R129 = RC0603JR-070RL: as R1 on sheet Sound_Card; Mouser Part Number: 603-RC0603JR-070RL; Mouser Price/Stock: https://www.mouser.co.uk/ProductDetail/YAGEO/RC0603JR-070RL?qs=2cAdsCoAWRGWyPcuXgGiXQ%3D%3D; Manufacturer_Part_Number: RC0603JR-070RL; Datasheet Link: https://datasheet.datasheetarchive.com/originals/distributors/Datasheets_SAMA/902f9e387b938f871d31120f5fc1d65e.pdf
TP17-TP24 = TP: as TP1 on sheet Sound_Card; Supplier 1: Digi-Key; RoHS: Yes; Category: Headers and Wire Housings; Stock 1: 227; Pricing 1: 1=2.85000, 10=2.73600, 100=2.28000, 500=1.93800, 1000=1.65300, 5000=1.48200 (USD); Mount: Through Hole; Contact Plating: Gold; Contact Material: Bronze; Housing Material: Polyester; Housing Color: Black; Color: Black; Min Operating Temperature: -55°C; Max Operating Temperature: 125°C; Number of Rows: 2; Termination: Solder; Packaging: Rail/Tube; Orientation: Straight; Number of Positions: 16; Length: 27.94mm; Depth: 9.27mm; Contact Mating Length: 0.25inch; REACH SVHC: No SVHC; ComponentLink1URL: https://datasheet.ciiva.com/739/tst-mkt-739845.pdf?src-supplier=Digi-Key; ComponentLink1Description: https://datasheet.ciiva.com/739/tst-mkt-739845.pdf?src-supplier=Digi-Key; ComponentLink2URL: https://datasheet.ciiva.com/10018/htst-10018510.pdf?src-supplier=Avnet; ComponentLink2Description: https://datasheet.ciiva.com/10018/htst-10018510.pdf?src-supplier=Avnet

## Sheet Sound_Card_LED_Monitor.SchDoc: Sound Card LED Monitor
size Tabloid; Date: 05/10/2023; Engineer: Terry D. Schevker; Revision: 1.0; SheetNumber: 4; SheetTotal: 4
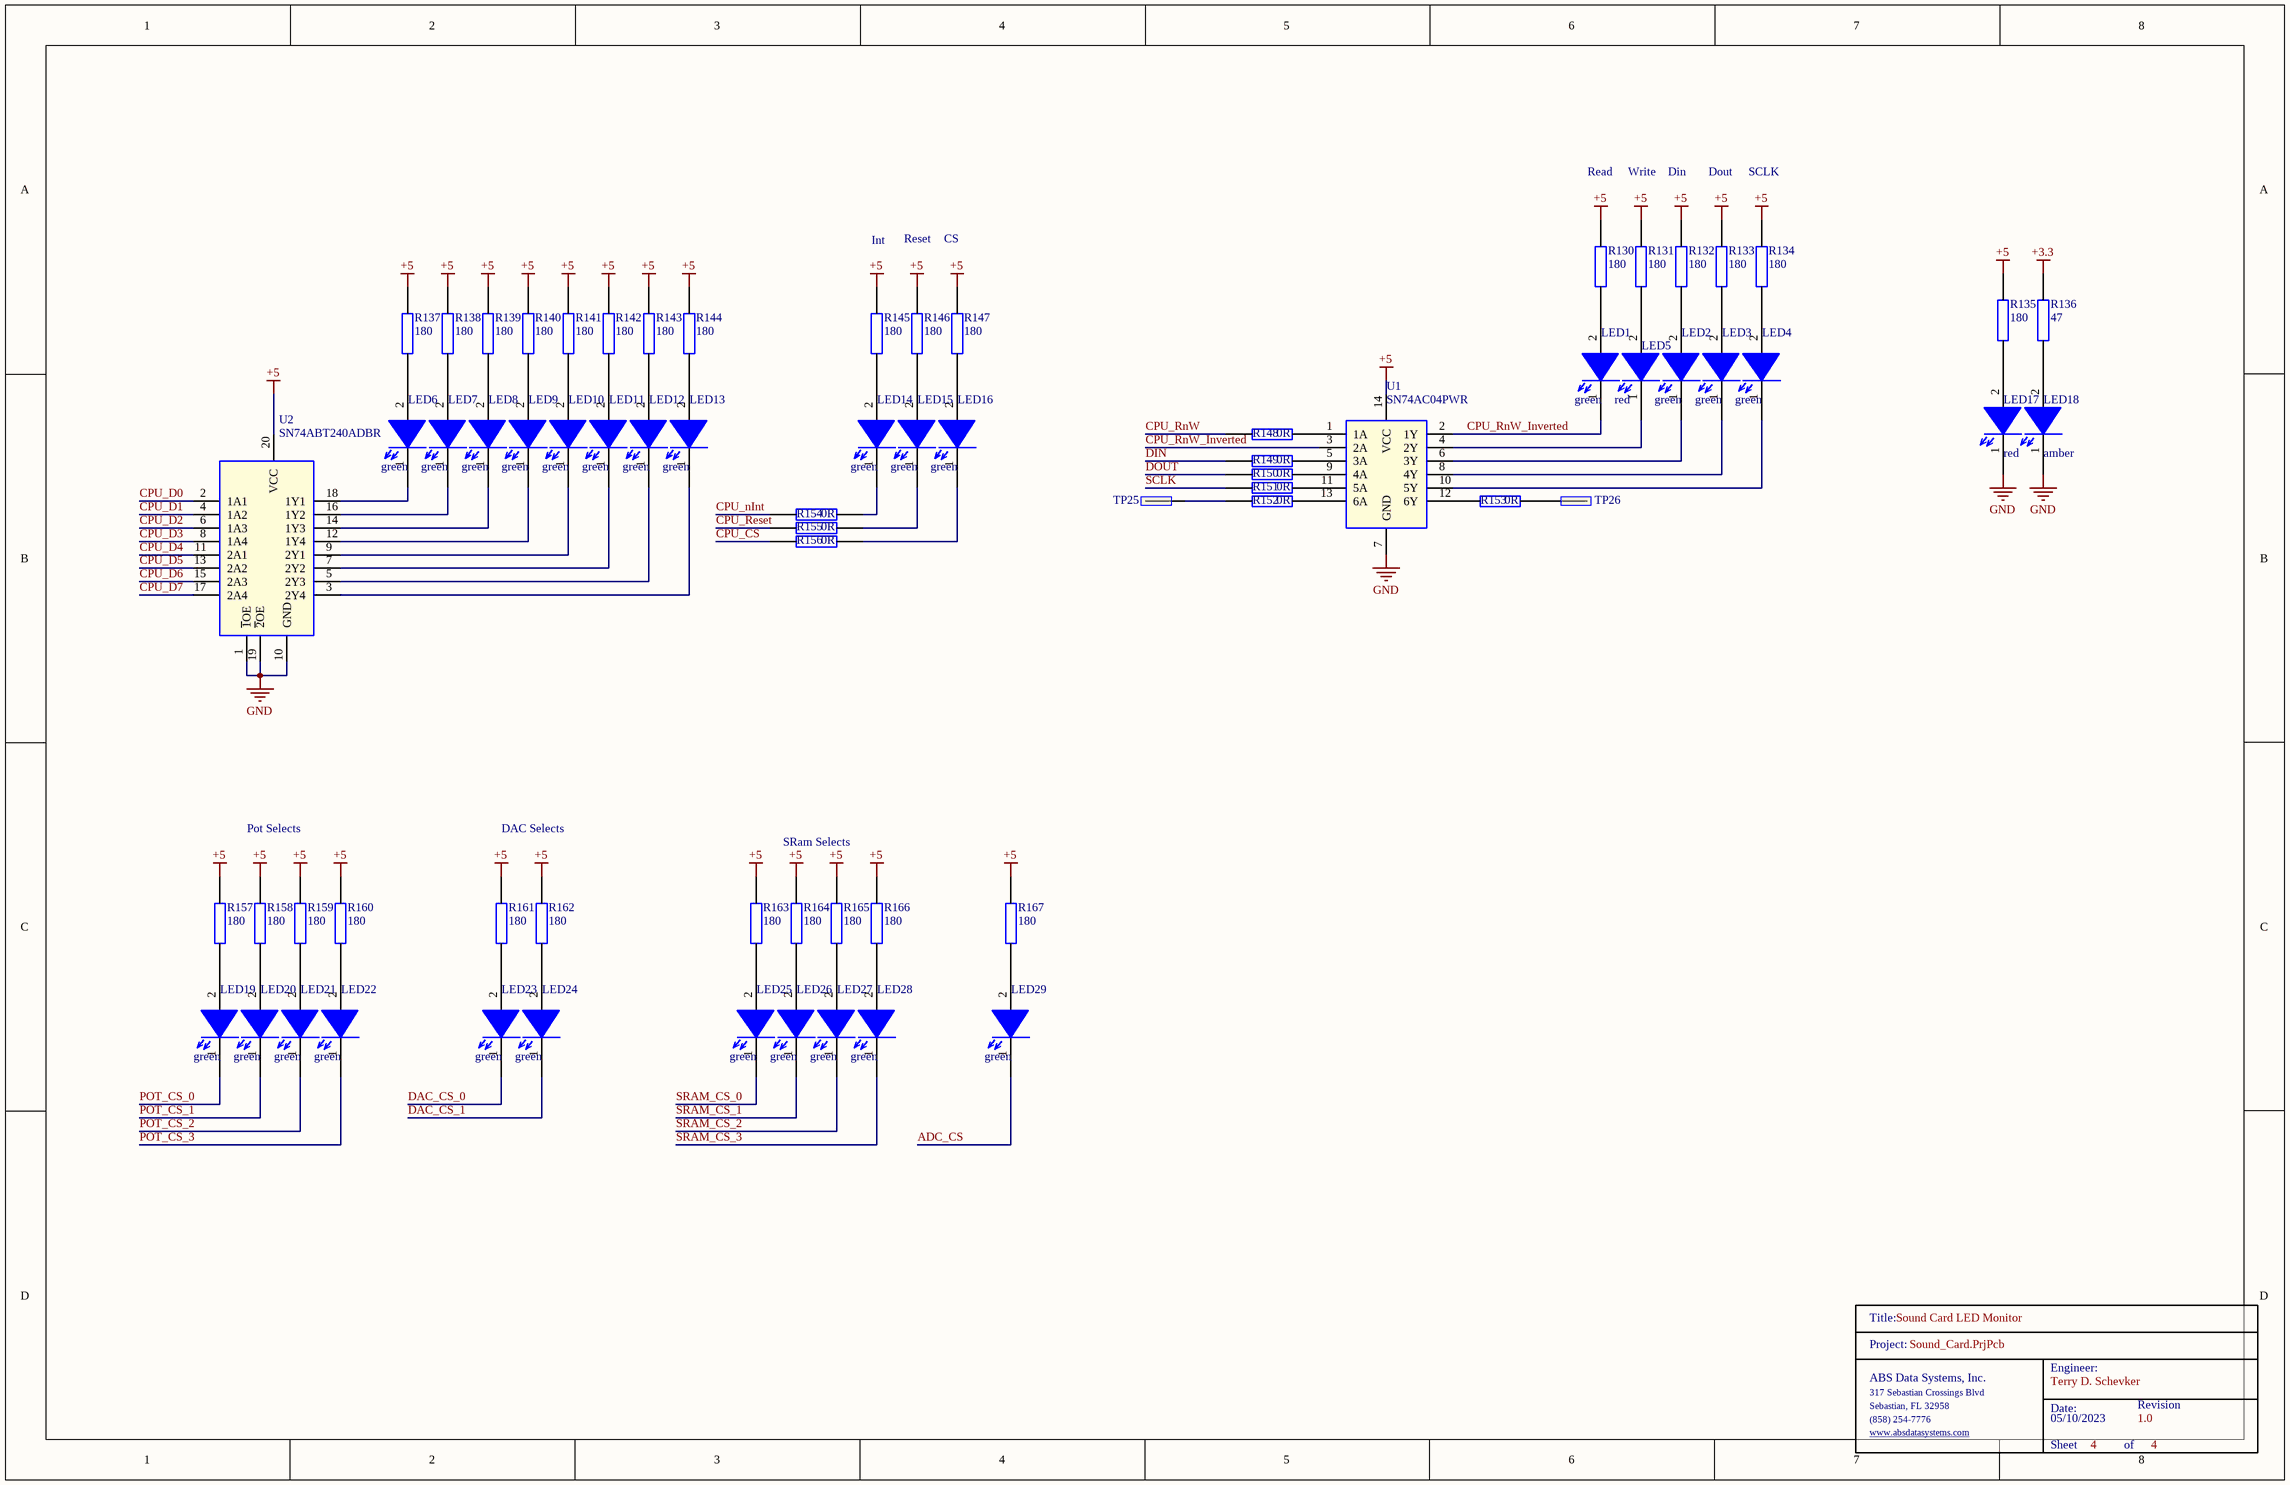
[diagram p3: Sound_Card_LED_Monitor.SchDoc]

### Parts
(Parts that share a designator on the sheet are numbered #1, #2 ... from top to bottom, then left to right.)
LED1  green  [0603_Diode]
LED2  green  [0603_Diode]
LED3  green  [0603_Diode]
LED4  green  [0603_Diode]
LED5  red  [0603_Diode]
LED6  green  [0603_Diode]
LED7  green  [0603_Diode]
LED8  green  [0603_Diode]
LED9  green  [0603_Diode]
LED10  green  [0603_Diode]
LED11  green  [0603_Diode]
LED12  green  [0603_Diode]
LED13  green  [0603_Diode]
LED14  green  [0603_Diode]
LED15  green  [0603_Diode]
LED16  green  [0603_Diode]
LED17  red  [0603_Diode]
LED18  amber  [0603_Diode]
LED19  green  [0603_Diode]
LED20  green  [0603_Diode]
LED21  green  [0603_Diode]
LED22  green  [0603_Diode]
LED23  green  [0603_Diode]
LED24  green  [0603_Diode]
LED25  green  [0603_Diode]
LED26  green  [0603_Diode]
LED27  green  [0603_Diode]
LED28  green  [0603_Diode]
LED29  green  [0603_Diode]
R130  180  [0603]
R131  180  [0603]
R132  180  [0603]
R133  180  [0603]
R134  180  [0603]
R135  180  [0603]
R136  47  [0603]
R137  180  [0603]
R138  180  [0603]
R139  180  [0603]
R140  180  [0603]
R141  180  [0603]
R142  180  [0603]
R143  180  [0603]
R144  180  [0603]
R145  180  [0603]
R146  180  [0603]
R147  180  [0603]
R148  0R  [0603]
R149  0R  [0603]
R150  0R  [0603]
R151  0R  [0603]
R152  0R  [0603]
R153  0R  [0603]
R154  0R  [0603]
R155  0R  [0603]
R156  0R  [0603]
R157  180  [0603]
R158  180  [0603]
R159  180  [0603]
R160  180  [0603]
R161  180  [0603]
R162  180  [0603]
R163  180  [0603]
R164  180  [0603]
R165  180  [0603]
R166  180  [0603]
R167  180  [0603]
TitleBlock_?#3  TitleBlock  (value not drawn)  (graphical)
TP25  TP  [TP]  (value not drawn)
TP26  TP  [TP]  (value not drawn)
U1  SN74AC04PWR  [SOP65P640X120-14N]
U2  SN74ABT240ADBR  [SOP65P780X200-20N]

### Nets
+3.3: R136.1
+5: R130.2 R131.2 R132.2 R133.2 R134.2 R135.2 R137.2 R138.2 R139.2 R140.2 R141.2 R142.2 R143.2 R144.2 R145.2 R146.2 R147.2 R157.2 R158.2 R159.2 R160.2 R161.2 R162.2 R163.2 R164.2 R165.2 R166.2 R167.2 U1.14(VCC) U2.20(VCC)
GND: LED17.1(K) LED18.1(K) U1.7(GND) U2.1(~{1}OE) U2.10(GND) U2.19(~{2}OE)
ADC_CS: LED29.1(K)
CPU_CS: R156.1
CPU_D0: U2.2(1A1)
CPU_D1: U2.4(1A2)
CPU_D2: U2.6(1A3)
CPU_D3: U2.8(1A4)
CPU_D4: U2.11(2A1)
CPU_D5: U2.13(2A2)
CPU_D6: U2.15(2A3)
CPU_D7: U2.17(2A4)
CPU_nInt: R154.1
CPU_Reset: R155.1
CPU_RnW: R148.1
CPU_RnW_Inverted: LED1.1(K) U1.2(1Y) U1.3(2A)
DAC_CS_0: LED23.1(K)
DAC_CS_1: LED24.1(K)
DIN: R149.1
DOUT: R150.1
POT_CS_0: LED19.1(K)
POT_CS_1: LED20.1(K)
POT_CS_2: LED21.1(K)
POT_CS_3: LED22.1(K)
SCLK: R151.1
SRAM_CS_0: LED25.1(K)
SRAM_CS_1: LED26.1(K)
SRAM_CS_2: LED27.1(K)
SRAM_CS_3: LED28.1(K)
NetLED1_2: LED1.2(A) R130.1
NetLED2_1: LED2.1(K) U1.6(3Y)
NetLED2_2: LED2.2(A) R132.1
NetLED3_1: LED3.1(K) U1.8(4Y)
NetLED3_2: LED3.2(A) R133.1
NetLED4_1: LED4.1(K) U1.10(5Y)
NetLED4_2: LED4.2(A) R134.1
NetLED5_1: LED5.1(K) U1.4(2Y)
NetLED5_2: LED5.2(A) R131.1
NetLED6_1: LED6.1(K) U2.18(1Y1)
NetLED6_2: LED6.2(A) R137.1
NetLED7_1: LED7.1(K) U2.16(1Y2)
NetLED7_2: LED7.2(A) R138.1
NetLED8_1: LED8.1(K) U2.14(1Y3)
NetLED8_2: LED8.2(A) R139.1
NetLED9_1: LED9.1(K) U2.12(1Y4)
NetLED9_2: LED9.2(A) R140.1
NetLED10_1: LED10.1(K) U2.9(2Y1)
NetLED10_2: LED10.2(A) R141.1
NetLED11_1: LED11.1(K) U2.7(2Y2)
NetLED11_2: LED11.2(A) R142.1
NetLED12_1: LED12.1(K) U2.5(2Y3)
NetLED12_2: LED12.2(A) R143.1
NetLED13_1: LED13.1(K) U2.3(2Y4)
NetLED13_2: LED13.2(A) R144.1
NetLED14_1: LED14.1(K) R154.2
NetLED14_2: LED14.2(A) R145.1
NetLED15_1: LED15.1(K) R155.2
NetLED15_2: LED15.2(A) R146.1
NetLED16_1: LED16.1(K) R156.2
NetLED16_2: LED16.2(A) R147.1
NetLED17_2: LED17.2(A) R135.1
NetLED18_2: LED18.2(A) R136.2
NetLED19_2: LED19.2(A) R157.1
NetLED20_2: LED20.2(A) R158.1
NetLED21_2: LED21.2(A) R159.1
NetLED22_2: LED22.2(A) R160.1
NetLED23_2: LED23.2(A) R161.1
NetLED24_2: LED24.2(A) R162.1
NetLED25_2: LED25.2(A) R163.1
NetLED26_2: LED26.2(A) R164.1
NetLED27_2: LED27.2(A) R165.1
NetLED28_2: LED28.2(A) R166.1
NetLED29_2: LED29.2(A) R167.1
NetR148_2: R148.2 U1.1(1A)
NetR149_2: R149.2 U1.5(3A)
NetR150_2: R150.2 U1.9(4A)
NetR151_2: R151.2 U1.11(5A)
NetR152_1: R152.1 TP25.1
NetR152_2: R152.2 U1.13(6A)
NetR153_1: R153.1 U1.12(6Y)
NetR153_2: R153.2 TP26.1

### Notes on the sheet
- Read
- Write
- Din
- Dout
- SCLK
- Int
- Reset
- CS
- Pot Selects
- DAC Selects
- SRam Selects
- (in symbol TitleBlock) Title:; Project:; Engineer:; ABS Data Systems, Inc.; 317 Sebastian Crossings Blvd; Sebastian, FL 32958; Date:; Revision; (858) 254-7776; www.absdatasystems.com; Sheet; of

### Library data of the parts
LED1-LED4 LED6-LED16 LED19-LED29 = 150060GS75000: Wurth Elektronik 0603 green; Manufacturer: Wurth Electronics; Wavelength: 520nm; Viewing Angle: 140°; Lens Style: Clear,Rectangular; Luminous Intensity: 430mcd; Forward Current: 30mA; Forward Voltage: 3.2V; Test Current: 20mA; Supplier 1: Digi-Key; Manufacturer Part Number: 150060GS75000; RoHS: Yes; Category: LEDs; Stock 1: 71509; Pricing 1: 1=0.14000, 50=0.13300, 100=0.11400, 500=0.09900 (USD); Mount: Surface Mount; Case/Package: 0603; Color: Green; Case Code (Metric): 1608; Case Code (Imperial): 0603; Min Operating Temperature: -40°C; Max Operating Temperature: 85°C; Package Quantity: 4000; Packaging: Tape and Reel; Dominant Wavelength: 520nm; Length: 1.6mm; Width: 0.8mm; Height: 0.7mm; REACH SVHC: Unknown; Lead Free: Lead Free; ComponentLink1URL: https://datasheet.ciiva.com/29562/150060gs75000-29562868.pdf?src-supplier=Digi-Key; ComponentLink1Description: https://datasheet.ciiva.com/29562/150060gs75000-29562868.pdf?src-supplier=Digi-Key; ComponentLink2URL: https://datasheet.ciiva.com/29279/759427-da-01-en-chipled-0603-w-kl-gruen-150060gs75000-29279201.pdf?src-supplier=Conrad; ComponentLink2Description: https://datasheet.ciiva.com/29279/759427-da-01-en-chipled-0603-w-kl-gruen-150060gs75000-29279201.pdf?src-supplier=Conrad; ComponentLink3URL: https://datasheet.ciiva.com/29562/150060gs75000-29562869.pdf?src-supplier=Digi-Key; ComponentLink3Description: https://datasheet.ciiva.com/29562/150060gs75000-29562869.pdf?src-supplier=Digi-Key; ComponentLink4URL: https://datasheet.ciiva.com/29562/150060gs75000-29562870.pdf?src-supplier=Digi-Key; ComponentLink4Description: https://datasheet.ciiva.com/29562/150060gs75000-29562870.pdf?src-supplier=Digi-Key
LED5 LED17 = 150060RS75000: Wurth Elektronik 0603 red; Manufacturer: Wurth Electronics; Manufacturer Part Number: 150060GS75000; Color: Green; Wavelength: 520nm; Viewing Angle: 140°; Lens Style: Clear,Rectangular; Luminous Intensity: 430mcd; Forward Current: 30mA; Forward Voltage: 3.2V; Test Current: 20mA; Supplier 1: Digi-Key; RoHS: Yes; Category: LEDs; Stock 1: 71509; Pricing 1: 1=0.14000, 50=0.13300, 100=0.11400, 500=0.09900 (USD); Mount: Surface Mount; Case/Package: 0603; Case Code (Metric): 1608; Case Code (Imperial): 0603; Min Operating Temperature: -40°C; Max Operating Temperature: 85°C; Package Quantity: 4000; Packaging: Tape and Reel; Dominant Wavelength: 520nm; Length: 1.6mm; Width: 0.8mm; Height: 0.7mm; REACH SVHC: Unknown; Lead Free: Lead Free; ComponentLink1URL: https://datasheet.ciiva.com/29562/150060gs75000-29562868.pdf?src-supplier=Digi-Key; ComponentLink1Description: https://datasheet.ciiva.com/29562/150060gs75000-29562868.pdf?src-supplier=Digi-Key; ComponentLink2URL: https://datasheet.ciiva.com/29279/759427-da-01-en-chipled-0603-w-kl-gruen-150060gs75000-29279201.pdf?src-supplier=Conrad; ComponentLink2Description: https://datasheet.ciiva.com/29279/759427-da-01-en-chipled-0603-w-kl-gruen-150060gs75000-29279201.pdf?src-supplier=Conrad; ComponentLink3URL: https://datasheet.ciiva.com/29562/150060gs75000-29562869.pdf?src-supplier=Digi-Key; ComponentLink3Description: https://datasheet.ciiva.com/29562/150060gs75000-29562869.pdf?src-supplier=Digi-Key; ComponentLink4URL: https://datasheet.ciiva.com/29562/150060gs75000-29562870.pdf?src-supplier=Digi-Key; ComponentLink4Description: https://datasheet.ciiva.com/29562/150060gs75000-29562870.pdf?src-supplier=Digi-Key
LED18 = 150060AS75000: Wurth Elektronik 0603 amber; Manufacturer: Wurth Electronics; Manufacturer Part Number: 150060GS75000; Color: Green; Wavelength: 520nm; Viewing Angle: 140°; Lens Style: Clear,Rectangular; Luminous Intensity: 430mcd; Forward Current: 30mA; Forward Voltage: 3.2V; Test Current: 20mA; Supplier 1: Digi-Key; RoHS: Yes; Category: LEDs; Stock 1: 71509; Pricing 1: 1=0.14000, 50=0.13300, 100=0.11400, 500=0.09900 (USD); Mount: Surface Mount; Case/Package: 0603; Case Code (Metric): 1608; Case Code (Imperial): 0603; Min Operating Temperature: -40°C; Max Operating Temperature: 85°C; Package Quantity: 4000; Packaging: Tape and Reel; Dominant Wavelength: 520nm; Length: 1.6mm; Width: 0.8mm; Height: 0.7mm; REACH SVHC: Unknown; Lead Free: Lead Free; ComponentLink1URL: https://datasheet.ciiva.com/29562/150060gs75000-29562868.pdf?src-supplier=Digi-Key; ComponentLink1Description: https://datasheet.ciiva.com/29562/150060gs75000-29562868.pdf?src-supplier=Digi-Key; ComponentLink2URL: https://datasheet.ciiva.com/29279/759427-da-01-en-chipled-0603-w-kl-gruen-150060gs75000-29279201.pdf?src-supplier=Conrad; ComponentLink2Description: https://datasheet.ciiva.com/29279/759427-da-01-en-chipled-0603-w-kl-gruen-150060gs75000-29279201.pdf?src-supplier=Conrad; ComponentLink3URL: https://datasheet.ciiva.com/29562/150060gs75000-29562869.pdf?src-supplier=Digi-Key; ComponentLink3Description: https://datasheet.ciiva.com/29562/150060gs75000-29562869.pdf?src-supplier=Digi-Key; ComponentLink4URL: https://datasheet.ciiva.com/29562/150060gs75000-29562870.pdf?src-supplier=Digi-Key; ComponentLink4Description: https://datasheet.ciiva.com/29562/150060gs75000-29562870.pdf?src-supplier=Digi-Key
R130-R135 R137-R147 R157-R167 = RC0603FR-13180RL: YAGEO 0603 180 ohm; Manufacturer_Name: KEMET; Manufacturer_Part_Number: RC0603JR-070RL; Geometry.Height: 0.55mm; Mouser Part Number: 603-RC0603JR-070RL; Mouser Price/Stock: https://www.mouser.co.uk/ProductDetail/YAGEO/RC0603JR-070RL?qs=2cAdsCoAWRGWyPcuXgGiXQ%3D%3D; Datasheet Link: https://datasheet.datasheetarchive.com/originals/distributors/Datasheets_SAMA/902f9e387b938f871d31120f5fc1d65e.pdf
R136 = RC0603FR-0747KL: YAGEO 0603 47; Manufacturer_Name: KEMET; Manufacturer_Part_Number: RC0603JR-070RL; Geometry.Height: 0.55mm; Mouser Part Number: 603-RC0603JR-070RL; Mouser Price/Stock: https://www.mouser.co.uk/ProductDetail/YAGEO/RC0603JR-070RL?qs=2cAdsCoAWRGWyPcuXgGiXQ%3D%3D; Datasheet Link: https://datasheet.datasheetarchive.com/originals/distributors/Datasheets_SAMA/902f9e387b938f871d31120f5fc1d65e.pdf
R148-R156 = RC0603JR-070RL: as R1 on sheet Sound_Card; Mouser Part Number: 603-RC0603JR-070RL; Mouser Price/Stock: https://www.mouser.co.uk/ProductDetail/YAGEO/RC0603JR-070RL?qs=2cAdsCoAWRGWyPcuXgGiXQ%3D%3D; Manufacturer_Part_Number: RC0603JR-070RL; Datasheet Link: https://datasheet.datasheetarchive.com/originals/distributors/Datasheets_SAMA/902f9e387b938f871d31120f5fc1d65e.pdf
TP25 TP26 = TP: as TP1 on sheet Sound_Card; Supplier 1: Digi-Key; RoHS: Yes; Category: Headers and Wire Housings; Stock 1: 227; Pricing 1: 1=2.85000, 10=2.73600, 100=2.28000, 500=1.93800, 1000=1.65300, 5000=1.48200 (USD); Mount: Through Hole; Contact Plating: Gold; Contact Material: Bronze; Housing Material: Polyester; Housing Color: Black; Color: Black; Min Operating Temperature: -55°C; Max Operating Temperature: 125°C; Number of Rows: 2; Termination: Solder; Packaging: Rail/Tube; Orientation: Straight; Number of Positions: 16; Length: 27.94mm; Depth: 9.27mm; Contact Mating Length: 0.25inch; REACH SVHC: No SVHC; ComponentLink1URL: https://datasheet.ciiva.com/739/tst-mkt-739845.pdf?src-supplier=Digi-Key; ComponentLink1Description: https://datasheet.ciiva.com/739/tst-mkt-739845.pdf?src-supplier=Digi-Key; ComponentLink2URL: https://datasheet.ciiva.com/10018/htst-10018510.pdf?src-supplier=Avnet; ComponentLink2Description: https://datasheet.ciiva.com/10018/htst-10018510.pdf?src-supplier=Avnet
U1 = SN74AC04PWR: Hex Inverters; Manufacturer_Name: Texas Instruments; Geometry.Height: 1.2mm; Mouser Part Number: 595-SN74AC04PWR; Mouser Price/Stock: https://www.mouser.co.uk/ProductDetail/Texas-Instruments/SN74AC04PWR?qs=RZS%252BpEsUn7pRvPNqsga4SA%3D%3D; Manufacturer_Part_Number: SN74AC04PWR; Datasheet Link: http://www.ti.com/lit/gpn/sn74ac04
U2 = SN74ABT240ADBR: Octal Buffers/Drivers With 3-State Outputs; Manufacturer_Name: Texas Instruments; Geometry.Height: 2mm; Mouser Part Number: 595-SN74ABT240ADBR; Mouser Price/Stock: https://www.mouser.co.uk/ProductDetail/Texas-Instruments/SN74ABT240ADBR?qs=JHHQeKcAU3Dt82k%252BVyiYdw%3D%3D; Manufacturer_Part_Number: SN74ABT240ADBR; Datasheet Link: http://www.ti.com/lit/gpn/sn74abt240a

## Nets that join several sheets
+3.3: Sound_Card (H1.3 TP1.1), Sound_Card_LED_Monitor (R136.1)
+5: Sound_Card (20 pins), Ampifiler (8 pins), Sound_Ram_Buffer (B14.8 B15.8 B16.8 B17.8), Sound_Card_LED_Monitor (30 pins)
GND: Sound_Card (26 pins), Ampifiler (20 pins), Sound_Ram_Buffer (B14.4 B15.4 B16.4 B17.4), Sound_Card_LED_Monitor (6 pins)
ADC_CS: Sound_Card (B1.1 R36.1), Sound_Card_LED_Monitor (LED29.1)
CPU_CS: Sound_Card (R12.2 R45.2), Sound_Card_LED_Monitor (R156.1)
CPU_D0: Sound_Card (R1.1 R17.1), Sound_Card_LED_Monitor (U2.2)
CPU_D1: Sound_Card (R3.1 R19.1), Sound_Card_LED_Monitor (U2.4)
CPU_D2: Sound_Card (R6.1 R21.1), Sound_Card_LED_Monitor (U2.6)
CPU_D3: Sound_Card (R9.1 R23.1), Sound_Card_LED_Monitor (U2.8)
CPU_D4: Sound_Card (R11.1 R27.1), Sound_Card_LED_Monitor (U2.11)
CPU_D5: Sound_Card (R13.1 R29.1), Sound_Card_LED_Monitor (U2.13)
CPU_D6: Sound_Card (R15.1 R31.1), Sound_Card_LED_Monitor (U2.15)
CPU_D7: Sound_Card (R16.1 R33.1), Sound_Card_LED_Monitor (U2.17)
CPU_nInt: Sound_Card (R7.2 R47.2), Sound_Card_LED_Monitor (R154.1)
CPU_Reset: Sound_Card (R14.2 R20.2), Sound_Card_LED_Monitor (R155.1)
CPU_RnW: Sound_Card (R10.2 R46.2), Sound_Card_LED_Monitor (R148.1)
DAC_CS_0: Sound_Card (R32.2 R57.1), Sound_Card_LED_Monitor (LED23.1)
DAC_CS_1: Sound_Card (R34.2 R64.1), Sound_Card_LED_Monitor (LED24.1)
DIN: Sound_Card (B1.6 R40.1 R55.1 R62.1), Ampifiler (R84.1 R85.1 R104.1 R105.1), Sound_Ram_Buffer (R110.1 R112.1 R122.1 R124.1), Sound_Card_LED_Monitor (R149.1)
DOUT: Sound_Card (B1.7 R42.1), Sound_Ram_Buffer (R108.1 R109.1 R120.1 R121.1), Sound_Card_LED_Monitor (R150.1)
Front_Left_Res: Sound_Card (C1.2), Ampifiler (R77.2)
Front_Left_Speaker: Sound_Card (R48.1), Ampifiler (C16.2)
Front_Right_Res: Sound_Card (C4.2), Ampifiler (R97.2)
Front_Right_Speaker: Sound_Card (R49.1), Ampifiler (C20.2)
POT_CS_0: Sound_Card (R22.2), Ampifiler (R76.1), Sound_Card_LED_Monitor (LED19.1)
POT_CS_1: Sound_Card (R24.2), Ampifiler (R96.1), Sound_Card_LED_Monitor (LED20.1)
POT_CS_2: Sound_Card (R28.2), Ampifiler (R78.1), Sound_Card_LED_Monitor (LED21.1)
POT_CS_3: Sound_Card (R30.2), Ampifiler (R98.1), Sound_Card_LED_Monitor (LED22.1)
Rear_Left_Res: Sound_Card (C7.2), Ampifiler (R79.2)
Rear_Left_Speaker: Sound_Card (R50.1), Ampifiler (C17.2)
Rear_Right_Res: Sound_Card (C8.2), Ampifiler (R99.2)
Rear_Right_Speaker: Sound_Card (R51.1), Ampifiler (C21.2)
SCLK: Sound_Card (B1.8 R44.1 R58.1 R65.1), Ampifiler (R80.1 R82.1 R100.1 R102.1), Sound_Ram_Buffer (R114.1 R116.1 R126.1 R128.1), Sound_Card_LED_Monitor (R151.1)
SRAM_CS_0: Sound_Card (R35.2), Sound_Ram_Buffer (R106.1), Sound_Card_LED_Monitor (LED25.1)
SRAM_CS_1: Sound_Card (R37.2), Sound_Ram_Buffer (R118.1), Sound_Card_LED_Monitor (LED26.1)
SRAM_CS_2: Sound_Card (R41.2), Sound_Ram_Buffer (R107.1), Sound_Card_LED_Monitor (LED27.1)
SRAM_CS_3: Sound_Card (R43.2), Sound_Ram_Buffer (R119.1), Sound_Card_LED_Monitor (LED28.1)